# Altium schematic sheet dram2.SCHDOC: Second DDR SDRAM
size A3; Organization: Berne University of Applied Science; Address1: School of Engineering and; Address2: Information Technology; Address3: Quellgasse 21; Address4: CH-2501 Biel; Revision: 1.0; SheetNumber: 10; SheetTotal: 19; ApprovedBy: zem1; Author: zac1
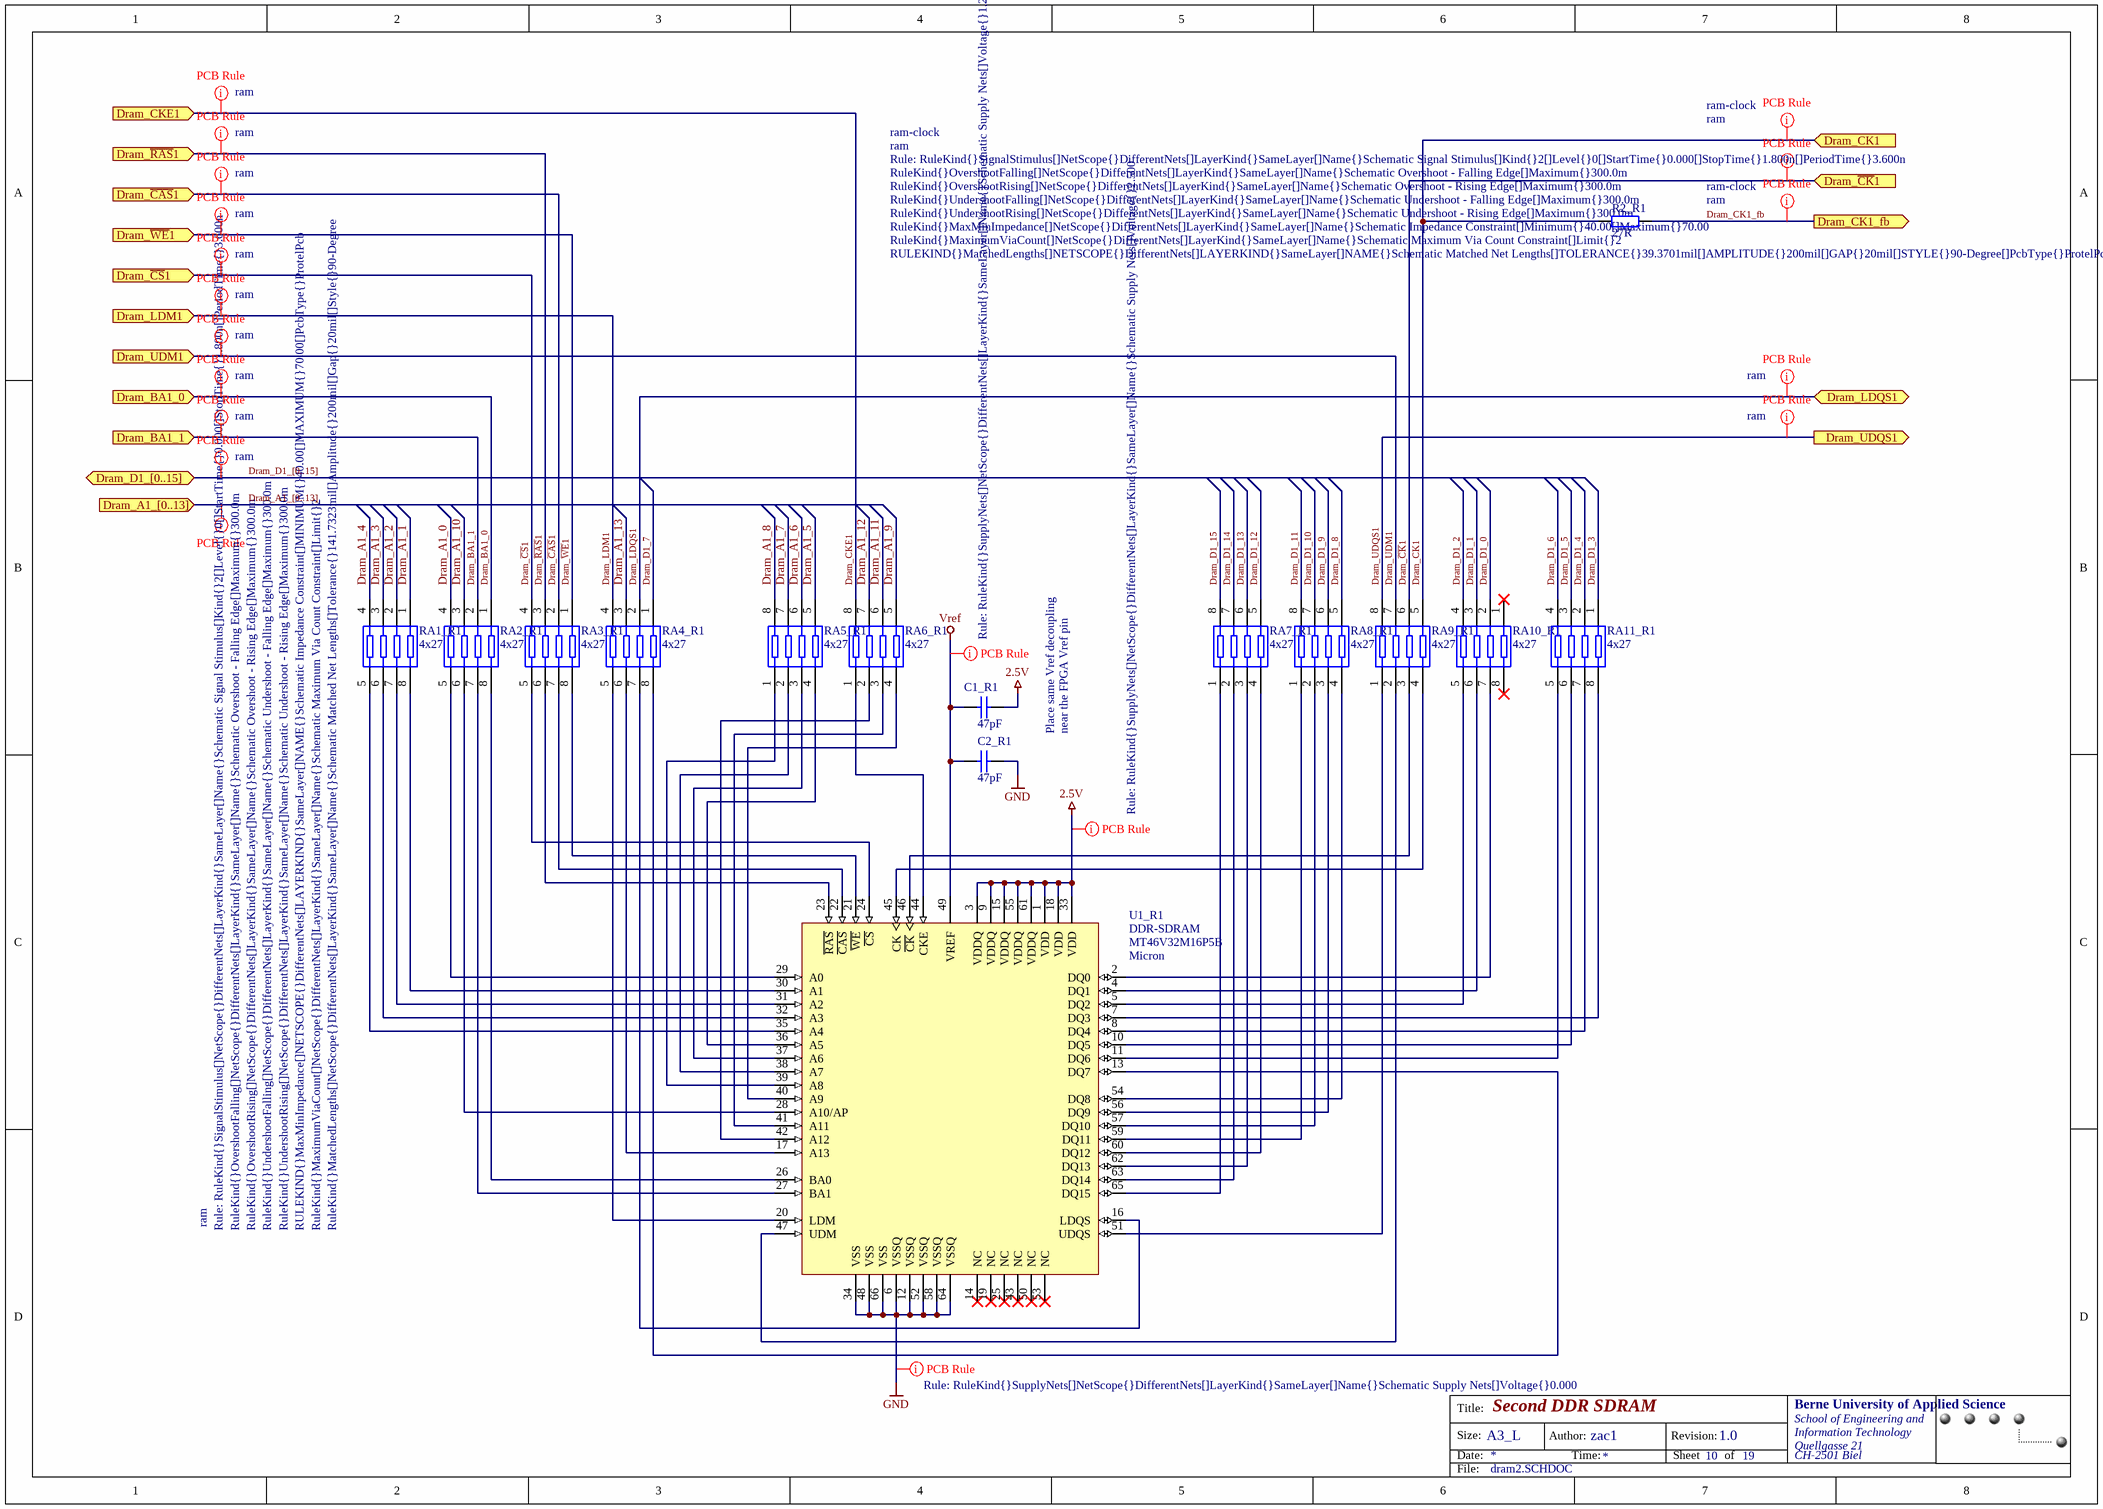
[diagram p0: dram2.SCHDOC]

## Parts
C1_R1  value 47pF  [0402]  (hidden comment: Cap)
C2_R1  value 47pF  [0402]  (hidden comment: Cap)
R2_R1  value 27R  [0402]  (hidden comment: Res2)
RA1_R1  value 4x27  [1206_ARRAY]
RA2_R1  value 4x27  [1206_ARRAY]
RA3_R1  value 4x27  [1206_ARRAY]
RA4_R1  value 4x27  [1206_ARRAY]
RA5_R1  value 4x27  [1206_ARRAY]
RA6_R1  value 4x27  [1206_ARRAY]
RA7_R1  value 4x27  [1206_ARRAY]
RA8_R1  value 4x27  [1206_ARRAY]
RA9_R1  value 4x27  [1206_ARRAY]
RA10_R1  value 4x27  [1206_ARRAY]
RA11_R1  value 4x27  [1206_ARRAY]
U1_R1  DDR-SDRAM  value MT46V32M16P5B  vendor: Micron  [TSOP66]

## Ports
Dram_A1_[0..13] (in), Dram_BA1_0 (in), Dram_BA1_1 (in), Dram_CK1 (in), Dram_CK1_fb (out), Dram_CKE1 (in), Dram_D1_[0..15] (bidir), Dram_LDM1 (in), Dram_LDQS1 (bidir), Dram_UDM1 (in), Dram_UDQS1 (out), Dram_~{CAS}1 (in), Dram_~{CK}1 (in), Dram_~{CS}1 (in), Dram_~{RAS}1 (in), Dram_~{WE}1 (in)

## Nets
2.5V: C1_R1.1 U1_R1.1(VDD) U1_R1.3(VDDQ) U1_R1.9(VDDQ) U1_R1.15(VDDQ) U1_R1.18(VDD) U1_R1.33(VDD) U1_R1.55(VDDQ) U1_R1.61(VDDQ)
GND: C2_R1.1 U1_R1.6(VSSQ) U1_R1.12(VSSQ) U1_R1.34(VSS) U1_R1.48(VSS) U1_R1.52(VSSQ) U1_R1.58(VSSQ) U1_R1.64(VSSQ) U1_R1.66(VSS)
Vref: C1_R1.2 C2_R1.2 U1_R1.49(VREF)
Dram_A1_0: RA2_R1.4
Dram_A1_1: RA1_R1.1
Dram_A1_2: RA1_R1.2
Dram_A1_3: RA1_R1.3
Dram_A1_4: RA1_R1.4
Dram_A1_5: RA5_R1.5
Dram_A1_6: RA5_R1.6
Dram_A1_7: RA5_R1.7
Dram_A1_8: RA5_R1.8
Dram_A1_9: RA6_R1.5
Dram_A1_10: RA2_R1.3
Dram_A1_11: RA6_R1.6
Dram_A1_12: RA6_R1.7
Dram_A1_13: RA4_R1.3
Dram_BA1_0: RA2_R1.1 ; port Dram_BA1_0
Dram_BA1_1: RA2_R1.2 ; port Dram_BA1_1
Dram_~{CAS}1: RA3_R1.2 ; port Dram_~{CAS}1
Dram_~{CK}1: RA9_R1.6 ; port Dram_~{CK}1
Dram_~{CS}1: RA3_R1.4 ; port Dram_~{CS}1
Dram_CK1: R2_R1.2 RA9_R1.5 ; port Dram_CK1
Dram_CK1_fb: R2_R1.1 ; port Dram_CK1_fb
Dram_CKE1: RA6_R1.8 ; port Dram_CKE1
Dram_D1_0: RA10_R1.2
Dram_D1_1: RA10_R1.3
Dram_D1_2: RA10_R1.4
Dram_D1_3: RA11_R1.1
Dram_D1_4: RA11_R1.2
Dram_D1_5: RA11_R1.3
Dram_D1_6: RA11_R1.4
Dram_D1_7: RA4_R1.1
Dram_D1_8: RA8_R1.5
Dram_D1_9: RA8_R1.6
Dram_D1_10: RA8_R1.7
Dram_D1_11: RA8_R1.8
Dram_D1_12: RA7_R1.5
Dram_D1_13: RA7_R1.6
Dram_D1_14: RA7_R1.7
Dram_D1_15: RA7_R1.8
Dram_LDM1: RA4_R1.4 ; port Dram_LDM1
Dram_LDQS1: RA4_R1.2 ; port Dram_LDQS1
Dram_~{RAS}1: RA3_R1.3 ; port Dram_~{RAS}1
Dram_UDM1: RA9_R1.7 ; port Dram_UDM1
Dram_UDQS1: RA9_R1.8 ; port Dram_UDQS1
Dram_~{WE}1: RA3_R1.1 ; port Dram_~{WE}1
NetRA1_R1_5: RA1_R1.5 U1_R1.35(A4)
NetRA1_R1_6: RA1_R1.6 U1_R1.32(A3)
NetRA1_R1_7: RA1_R1.7 U1_R1.31(A2)
NetRA1_R1_8: RA1_R1.8 U1_R1.30(A1)
NetRA2_R1_5: RA2_R1.5 U1_R1.29(A0)
NetRA2_R1_6: RA2_R1.6 U1_R1.28(A10/AP)
NetRA2_R1_7: RA2_R1.7 U1_R1.27(BA1)
NetRA2_R1_8: RA2_R1.8 U1_R1.26(BA0)
NetRA3_R1_5: RA3_R1.5 U1_R1.24(~{CS})
NetRA3_R1_6: RA3_R1.6 U1_R1.23(~{RAS})
NetRA3_R1_7: RA3_R1.7 U1_R1.22(~{CAS})
NetRA3_R1_8: RA3_R1.8 U1_R1.21(~{WE})
NetRA4_R1_5: RA4_R1.5 U1_R1.20(LDM)
NetRA4_R1_6: RA4_R1.6 U1_R1.17(A13)
NetRA4_R1_7: RA4_R1.7 U1_R1.16(LDQS)
NetRA4_R1_8: RA4_R1.8 U1_R1.13(DQ7)
NetRA5_R1_1: RA5_R1.1 U1_R1.39(A8)
NetRA5_R1_2: RA5_R1.2 U1_R1.38(A7)
NetRA5_R1_3: RA5_R1.3 U1_R1.37(A6)
NetRA5_R1_4: RA5_R1.4 U1_R1.36(A5)
NetRA6_R1_1: RA6_R1.1 U1_R1.44(CKE)
NetRA6_R1_2: RA6_R1.2 U1_R1.42(A12)
NetRA6_R1_3: RA6_R1.3 U1_R1.41(A11)
NetRA6_R1_4: RA6_R1.4 U1_R1.40(A9)
NetRA7_R1_1: RA7_R1.1 U1_R1.65(DQ15)
NetRA7_R1_2: RA7_R1.2 U1_R1.63(DQ14)
NetRA7_R1_3: RA7_R1.3 U1_R1.62(DQ13)
NetRA7_R1_4: RA7_R1.4 U1_R1.60(DQ12)
NetRA8_R1_1: RA8_R1.1 U1_R1.59(DQ11)
NetRA8_R1_2: RA8_R1.2 U1_R1.57(DQ10)
NetRA8_R1_3: RA8_R1.3 U1_R1.56(DQ9)
NetRA8_R1_4: RA8_R1.4 U1_R1.54(DQ8)
NetRA9_R1_1: RA9_R1.1 U1_R1.51(UDQS)
NetRA9_R1_2: RA9_R1.2 U1_R1.47(UDM)
NetRA9_R1_3: RA9_R1.3 U1_R1.46(~{CK})
NetRA9_R1_4: RA9_R1.4 U1_R1.45(CK)
NetRA10_R1_5: RA10_R1.5 U1_R1.5(DQ2)
NetRA10_R1_6: RA10_R1.6 U1_R1.4(DQ1)
NetRA10_R1_7: RA10_R1.7 U1_R1.2(DQ0)
NetRA11_R1_5: RA11_R1.5 U1_R1.11(DQ6)
NetRA11_R1_6: RA11_R1.6 U1_R1.10(DQ5)
NetRA11_R1_7: RA11_R1.7 U1_R1.8(DQ4)
NetRA11_R1_8: RA11_R1.8 U1_R1.7(DQ3)

Not connected (* = marked no-connect by the designer): RA10_R1 1* 8*; U1_R1 14(NC)* 19(NC)* 25(NC)* 43(NC)* 50(NC)* 53(NC)*

## Buses and harness runs
bus Dram_A1_[0..13] = port Dram_A1_[0..13]
bus Dram_D1_[0..15] = port Dram_D1_[0..15]

## Layout directives
rule Supply Nets [Voltage =  2.500]: 2.5V
rule Supply Nets [Voltage =  1.250]: Vref
rule Supply Nets [Voltage =  0.000]: GND
rule Signal Stimulus [Kind - Periodic Pulse    Level - Low    Start Time =  0.000    Stop Time =  1.800n    Period Time =  3.600n]; rule Overshoot - Falling Edge [Max =  300.0m]; rule Overshoot - Rising Edge [Max =  300.0m]; rule Undershoot - Falling Edge [Max =  300.0m]; rule Undershoot - Rising Edge [Max =  300.0m]; rule Impedance Constraint [Min = 40.00    Max = 70.00    ]; rule Maximum Via Count Constraint [Max Count = 2]; rule Matched Net Lengths [Tolerance = 3.6mm    Style - 90 Degrees    Amplitude = 5.08mm    Gap = 0.508mm    ]; net class ram: (no net found under the mark)
net class ram: (no net found under the mark), Dram_BA1_0, Dram_BA1_1, Dram_CKE1, Dram_LDM1, Dram_LDQS1, Dram_UDM1, Dram_UDQS1, Dram_~{CAS}1, Dram_~{CS}1, Dram_~{RAS}1, Dram_~{WE}1
net class ram-clock; net class ram: Dram_CK1, Dram_CK1_fb
rule Signal Stimulus [Kind - Periodic Pulse    Level - Low    Start Time =  0.000    Stop Time =  1.800n    Period Time =  3.600n]; rule Overshoot - Falling Edge [Max =  300.0m]; rule Overshoot - Rising Edge [Max =  300.0m]; rule Undershoot - Falling Edge [Max =  300.0m]; rule Undershoot - Rising Edge [Max =  300.0m]; rule Impedance Constraint [Min =  40.00    Max =  70.00    ]; rule Maximum Via Count Constraint [Max Count = 2]; rule Matched Net Lengths [Tolerance = 1mm    Style - 90 Degrees    Amplitude = 5.08mm    Gap = 0.508mm    ]; net class ram-clock; net class ram: Dram_~{CK}1

## Notes on the sheet
- Place same Vref decoupling
- near the FPGA Vref pin
- Title:
- Size:
- Date:
- A3_L
- Author:
- Time:
- Revision:
- Sheet
- of
- File:

## Library data of the parts
C1_R1 C2_R1 = Cap: Capacitor; Manufacturer: Murata; Part Number: GRM1555C1H470JZ01D; Class I: Passive; Currency: CHF; Packaging unit: 10; Prize: 0.07; Published: 8-Jun-2000; Revision: July-2002: Re-released for DXP Platform.; Publisher: Altium Limited; Class II: Capacitor; Distributor Number: 8819 670; RoHS: yes; Distributor: Farnell
R2_R1 = Res2: Resistor; Manufacturer: PHYCOMP; Part Number: 232270672709; Class I: Passive; Currency: CHF; Packaging unit: 50; Prize: 0.12; Published: 8-Jun-2000; Revision: July-2002: Re-released for DXP Platform.; Publisher: Altium Limited; Class II: Resistor; Distributor Number: 9239049; RoHS: yes; Distributor: Farnell
RA1_R1 RA2_R1 RA3_R1 RA4_R1 RA5_R1 RA6_R1 RA7_R1 RA8_R1 RA9_R1 RA10_R1 RA11_R1 = R_ARRAY_4_SMD: Manufacturer: PHYCOMP; Part Number: 235003410279; Currency: CHF; Packaging unit: 10; Prize: 0.17; Distributor Number: 9234969; RoHS: yes; Distributor: Farnell
U1_R1 = DDR-SDRAM: general model for ddr sdram's; Currency: CHF; lead time: 12 Weeks; Packaging unit: 108; Prize: 15.87; Distributor Number: MT46V32M16P5B; Manufacturer: Micron; Part Number: MT46V32M16P5B; RoHS: yes; Distributor: Silica